# EAGLE design sbc_smps_v0001 (EAGLE 6.4)
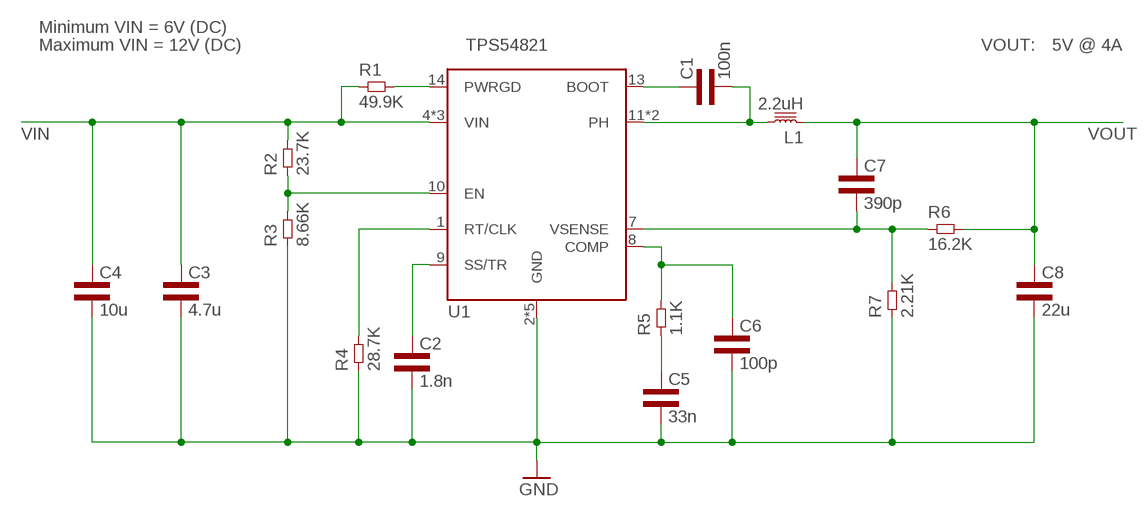
[diagram p0: schematic, sheet 1]

## Parts
C1  100n  CAP0603L3  [0603L3]
C2  1.8n  CAP0402L3  [0402L3]
C3  4.7u  CAP0805L3  [0805L3]
C4  10u  CAP1206L3  [1206L3]
C5  33n  CAP0402L3  [0402L3]
C6  100p  CAP0402L3  [0402L3]
C7  390p  CAP0402L3  [0402L3]
C8  22u  CAP1206L3  [1206L3]
L1  2.2uH  INDUCTOR5752  [5.7X5.2]
R1  49.9K  RES0402L3  [0402L3]
R2  23.7K  RES0402L3  [0402L3]
R3  8.66K  RES0402L3  [0402L3]
R4  28.7K  RES0402L3  [0402L3]
R5  1.1K  RES0402L3  [0402L3]
R6  16.2K  RES0402L3  [0402L3]
R7  2.21K  RES0402L3  [0402L3]
U1  TPS54821  [VQFN-14]

## Nets
GND: C2.P$2 C3.2 C4.2 C5.P$2 C6.P$2 C8.2 R3.P$1 R4.P$1 R7.P$1 U1.2(GND) U1.3(GND) U1.TP@1(GND) U1.TP@2(GND) U1.TP@3(GND)
N$1: C1.P$1 U1.13(BOOT)
N$2: C1.P$2 L1.2 U1.11(PH) U1.12(PH)
N$4: R1.P$2 U1.14(PWRGD)
N$6: R2.P$1 R3.P$2 U1.10(EN)
N$7: C2.P$1 U1.9(SS/TR)
N$8: R4.P$2 U1.1(RT/CLK)
N$9: C6.P$1 R5.P$2 U1.8(COMP)
N$10: C5.P$1 R5.P$1
N$11: C7.P$2 R6.P$1 R7.P$2 U1.7(VSENSE)
VIN: C3.1 C4.1 R1.P$1 R2.P$2 U1.4(VIN) U1.5(VIN) U1.6(VIN)
VOUT: C7.P$1 C8.1 L1.1 R6.P$2

## Notes on the sheet
- Minimum VIN = 6V (DC)
- Maximum VIN = 12V (DC) | VOUT: | 5V @ 4A

## Library data of the parts
C1-C8 = common:CAP
L1 = common:INDUCTOR
R1-R7 = common:RES
U1 = common:TPS54821

## Board
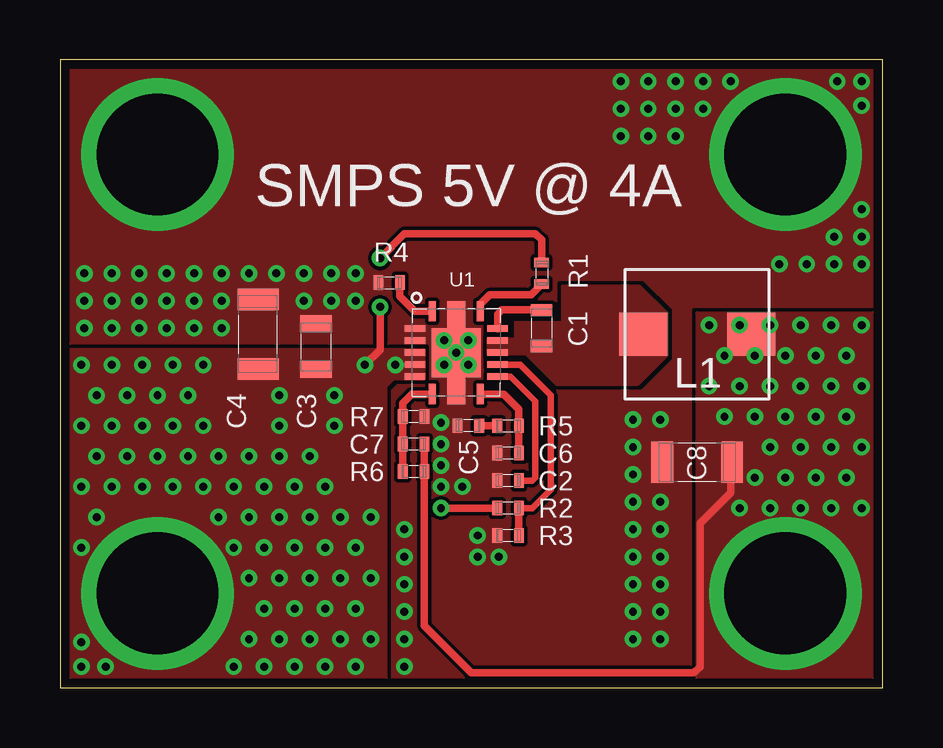
[diagram p1: board, top side]
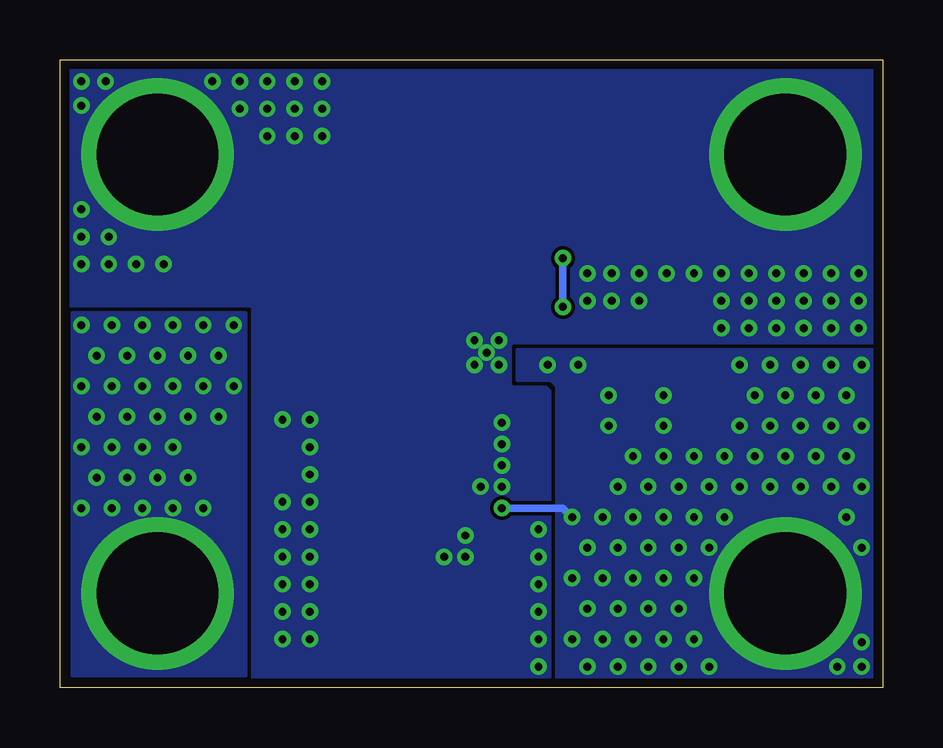
[diagram p2: board, bottom side, seen from below]

Size 34.29 x 26.16 mm. Coordinates in mm from the lower left corner, seen from the top.
Outline: 0,0 34.29,0 34.29,26.16 0,26.16 0,0
Copper layers (1*16): Top 0.035mm / dielectric 1.5mm / Bottom 0.035mm
Design rules "default *": minimum track width 5mil, minimum drill 13mil, track to track 6mil, track to pad 6mil, pad to pad 6mil, via to via 6mil, smd to smd 6mil, copper to edge 15mil, drill to drill 8mil, minimum pad ring 7mil, minimum via ring 7mil, stop-mask expansion 4mil, vias tented up to drill 16mil, thermal gap 10mil

### Footprints (pad centres in the part's own frame; a part is rotated, then mirrored left to right if it is on the bottom)
0603L3 = smd 0.5 x 0.9: P$1 -0.75,0; P$2 0.75,0
0402L3 = smd 0.4 x 0.6: P$1 -0.45,0; P$2 0.45,0
0805L3 = smd 0.7 x 1.3: 1 -0.95,0; 2 0.95,0
1206L3 = smd 0.9 x 1.7: 1 -1.45,0; 2 1.45,0
5.7X5.2 = smd 2 x 1.8: 1 -2.25,0; 2 2.25,0
VQFN-14 = smd 0.85 x 0.28: 1 -1.725,-1; 7 1.725,-1; 8 1.725,1; 14 -1.725,1 | smd 0.28 x 0.85: 2 -1,-1.725; 3 -0.5,-1.725; 4 0,-1.725; 5 0.5,-1.725; 6 1,-1.725; 9 1,1.725; 10 0.5,1.725; 11 0,1.725; 12 -0.5,1.725; 13 -1,1.725 | smd 2.05 x 2.05: TP@1 0,0 | smd 1.125 x 0.75: TP@2 -1.587,0; TP@3 1.587,0

### Placement (x,y rotation side)
C1  20.07,14.99 270 top
C2  18.67,8.64 180 top
C3  10.67,14.22 90 top
C4  8.26,14.73 90 top
C5  17.02,10.92 180 top
C6  18.67,9.78 180 top
C7  14.73,10.16 180 top
C8  26.54,9.4 180 top
L1  26.54,14.73 180 top
R1  20.07,17.27 270 top
R2  18.67,7.49 180 top
R3  18.67,6.35 0 top
R4  13.72,16.89 0 top
R5  18.67,10.92 0 top
R6  14.73,9.02 0 top
R7  14.73,11.3 180 top
U1  16.51,13.97 270 top

### Tracks (layer width: path | path; a pad name or v marks a point on that pad's centre or on a via)
GND  (via drill 0.33, 5.08 pad 6.35)
  other vias: 16.51,13.97 16,14.48 16,13.46 17.02,13.46 17.02,14.48 14.35,5.46 4.06,22.23 30.23,22.23 1.02,14.99 2.16,14.99 3.3,14.99 4.45,14.99 5.59,14.99 6.73,14.99 1.02,16.13 2.16,16.13 3.3,16.13 4.45,16.13 5.59,16.13 6.73,16.13 1.02,17.27 2.16,17.27 3.3,17.27 4.45,17.27 5.59,17.27 6.73,17.27 7.87,17.27 9.02,17.27 10.16,17.27 10.16,16.13 11.3,17.27 11.3,16.13 12.32,17.27 12.32,16.13 14.35,6.6 14.35,4.32 14.35,3.18 14.35,2.03 14.35,0.89 15.87,11.05 15.87,10.16 25.02,11.18 25.02,7.75 23.88,11.18 23.88,10.03 23.88,8.89 23.88,7.75 25.02,6.6 25.02,5.46 25.02,4.32 25.02,3.18 25.02,2.03 23.88,6.6 23.88,5.46 23.88,4.32 23.88,3.18 23.88,2.03 33.4,17.65 32.26,17.65 31.12,17.65 29.97,17.65 33.4,18.8 32.26,18.8 33.4,19.94 33.4,25.27 33.4,24.26 32.38,25.27 27.94,25.27 26.8,25.27 25.65,25.27 24.51,25.27 23.37,25.27 23.37,24.13 24.51,24.13 25.65,24.13 26.8,24.13 23.37,22.99 24.51,22.99 25.65,22.99 15.87,9.27 15.87,8.38 16.76,8.38 17.4,6.35 17.4,5.46 18.29,5.46
  pour Top (rank 6, no thermals): 0.38,25.78 33.91,25.78 33.91,0.38 0.38,0.38
  pour Bottom (rank 6, no thermals): 0.38,25.78 33.91,25.78 33.91,0.38 0.38,0.38
N$1
  Top 0.305: U1.13 18.23,15.57 18.41,15.75 20.05,15.75 C1.P$1
N$2
  pour Top (no thermals): 17.84,14.54 18.99,14.54 18.99,15.24 20.96,15.24 20.96,16.76 24.13,16.76 25.27,15.62 25.27,13.84 24.07,12.64 20.7,12.64 19.43,13.91 17.84,13.91
N$4
  Top 0.305: U1.14 17.51,15.99 17.91,16.38 19.63,16.38 R1.P$2
N$6
  Top 0.279: U1.10 19.17,13.47 20.45,12.19 20.45,8.26 19.68,7.49 R2.P$1
  Top 0.305: R2.P$1 R3.P$2
N$7
  Top 0.279: U1.9 18.78,12.97 19.81,11.94 19.81,8.76 19.68,8.64 C2.P$1
N$8
  Top 0.305: U1.1 14.79,15.7 14.17,16.31 R4.P$2
N$9
  Top 0.305: C6.P$1 R5.P$2 19.12,11.62 18.49,12.25 U1.8
N$10
  Top 0.305: C5.P$1 R5.P$1
N$11
  Top 0.305: R6.P$1 C7.P$2 R7.P$2 14.28,11.87 14.66,12.25 U1.7
VIN  (via drill 0.33, 5.08 pad 6.35)
  Top 0.305: R1.P$1 20.07,18.67 19.81,18.92 14.35,18.92 v13.34,17.91 | R2.P$2 v15.87,7.49 | v13.34,15.88 13.34,14.1 v12.7,13.46
  Bottom 0.305: v15.87,7.49 13.34,7.49 v12.95,7.11 | v13.34,17.91 v13.34,15.88
  other vias: 4.06,3.94 13.97,13.46 0.89,13.46 2.16,13.46 3.43,13.46 4.7,13.46 5.97,13.46 1.52,12.19 2.79,12.19 4.06,12.19 5.33,12.19 0.89,10.92 2.16,10.92 3.43,10.92 4.7,10.92 5.97,10.92 1.52,9.65 2.79,9.65 4.06,9.65 5.33,9.65 6.6,9.65 7.87,9.65 9.14,9.65 10.41,9.65 0.89,8.38 2.16,8.38 3.43,8.38 4.7,8.38 5.97,8.38 7.24,8.38 8.51,8.38 9.78,8.38 11.05,8.38 9.14,10.92 9.14,12.19 11.43,10.92 11.43,12.19 1.52,7.11 6.6,7.11 7.87,7.11 9.14,7.11 10.41,7.11 11.68,7.11 7.24,5.84 8.51,5.84 9.78,5.84 11.05,5.84 12.32,5.84 7.87,4.57 9.14,4.57 10.41,4.57 11.68,4.57 12.95,4.57 8.51,3.3 9.78,3.3 11.05,3.3 12.32,3.3 7.87,2.03 9.14,2.03 10.41,2.03 11.68,2.03 12.95,2.03 8.51,0.89 9.78,0.89 11.05,0.89 12.32,0.89 7.24,0.89 0.89,0.89 1.91,0.89 0.89,1.91 0.89,5.84
  pour Top (no thermals): 15.18,14.1 0.38,14.1 0.38,0.38 13.59,0.38 13.59,12.57 13.91,12.89 15.18,12.89
  pour Bottom: 0.38,14.1 15.24,14.1 15.24,12.83 13.84,12.83 13.59,12.57 13.59,0.38 0.38,0.38
VOUT  (via drill 0.33, 5.08 pad 6.35)
  Top 0.305: C7.P$1 R6.P$2 15.18,2.6 17.15,0.64 26.42,0.64 26.67,0.89 26.67,6.86 27.94,8.13 27.94,9.34 C8.1
  other vias: 30.23,3.94 27.05,15.11 28.32,15.11 29.59,15.11 30.86,15.11 32.13,15.11 33.4,15.11 27.69,13.84 28.96,13.84 30.23,13.84 31.5,13.84 32.77,13.84 27.05,12.57 28.32,12.57 29.59,12.57 30.86,12.57 32.13,12.57 33.4,12.57 27.69,11.3 28.96,11.3 30.23,11.3 31.5,11.3 32.77,11.3 29.59,10.03 30.86,10.03 32.13,10.03 33.4,10.03 28.96,8.76 30.23,8.76 31.5,8.76 32.77,8.76 28.32,7.49 29.59,7.49 30.86,7.49 32.13,7.49 33.4,7.49
  pour Top (no thermals): 26.54,15.62 33.91,15.62 33.91,0.51 33.91,0.38 26.54,0.38
  pour Bottom: 26.54,15.62 33.78,15.62 33.78,0.51 26.54,0.51

### Text on the board
tPlace: SMPS 5V @ 4A